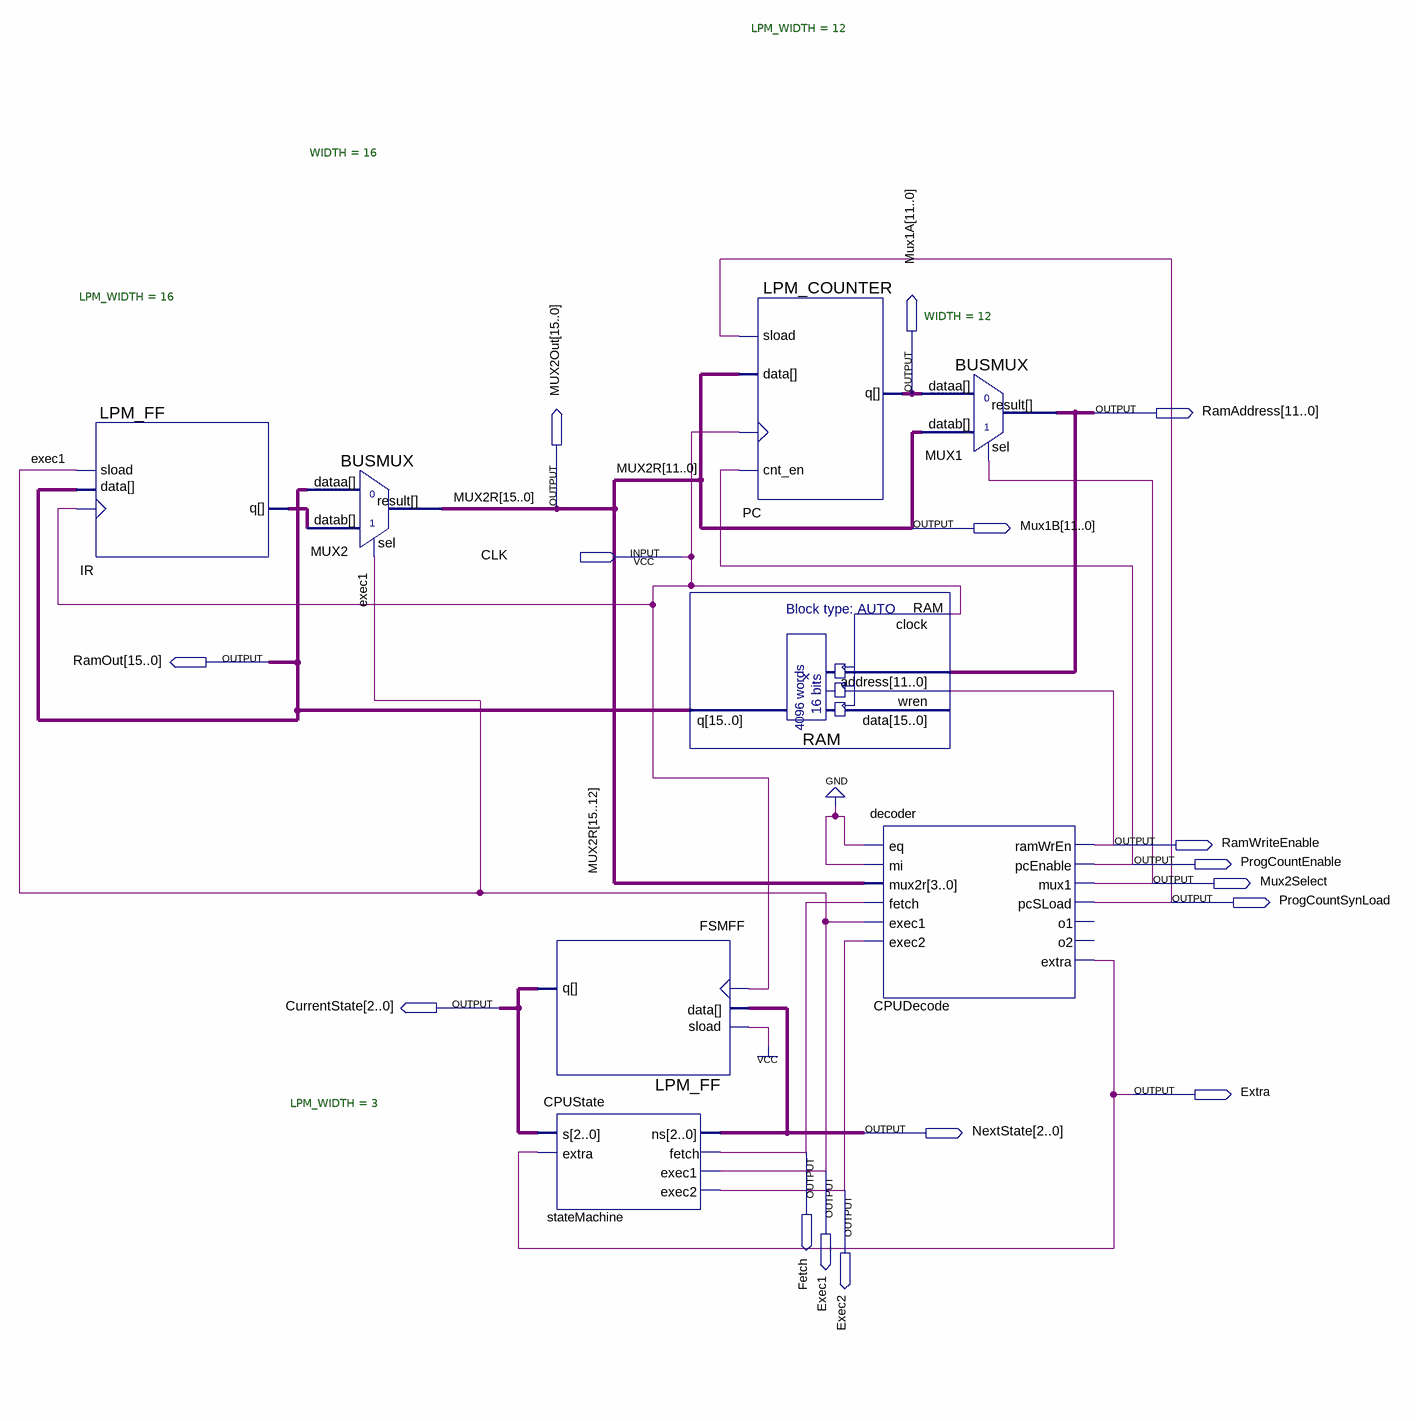
[diagram p0: schematic sheet]
// Quartus schematic MU0CPU.bdf as structural Verilog: 8 symbols, 16 pins
module MU0CPU (
  input  CLK,
  output [11:0] Mux1A,
  output [11:0] RamAddress,
  output [15:0] MUX2Out,
  output [11:0] Mux1B,
  output [15:0] RamOut,
  output RamWriteEnable,
  output ProgCountEnable,
  output Mux2Select,
  output ProgCountSynLoad,
  output [2:0] CurrentState,
  output Extra,
  output [2:0] NextState,
  output Fetch,
  output Exec1,
  output Exec2
);

  wire [15:0] IR_q;

  LPM_FF #(.LPM_WIDTH(16)) IR (.clock(CLK), .sload(Exec1), .data(RamOut), .q(IR_q));
  BUSMUX #(.WIDTH(16)) MUX2 (.datab(IR_q), .sel(Exec1), .dataa(RamOut), .result({MUX2Out[15:12], Mux1B}));
  LPM_FF #(.LPM_WIDTH(3)) FSMFF (.clock(CLK), .sload(1'b1), .data(NextState), .q(CurrentState));
  CPUState stateMachine (.s(CurrentState), .extra(Extra), .ns(NextState), .fetch(Fetch), .exec1(Exec1), .exec2(Exec2));
  RAM RAM (.wren(RamWriteEnable), .address(RamAddress), .clock(CLK), .q(RamOut));  // open: data
  LPM_COUNTER #(.LPM_WIDTH(12)) PC (
    .sload(ProgCountSynLoad), .data(Mux1B), .clock(CLK), .cnt_en(ProgCountEnable), .q(Mux1A));
  BUSMUX #(.WIDTH(12)) MUX1 (.datab(Mux1B), .sel(Mux2Select), .dataa(Mux1A), .result(RamAddress));
  decoder CPUDecode (
    .eq(1'b0), .mi(1'b0), .mux2r(MUX2Out[15:12]), .fetch(Fetch), .exec1(Exec1), .exec2(Exec2),
    .ramWrEn(RamWriteEnable), .pcEnable(ProgCountEnable), .mux1(Mux2Select), .pcSLoad(ProgCountSynLoad),
    .extra(Extra));  // open: o1, o2

  assign MUX2Out[11:0] = Mux1B;

  // Other names for the same wires on the sheet: MUX2R[15:0] = {MUX2Out[15:12], Mux1B}
endmodule
